# Altium schematic sheet Schematic.SchDoc
size A4; SheetNumber: 1; SheetTotal: 4
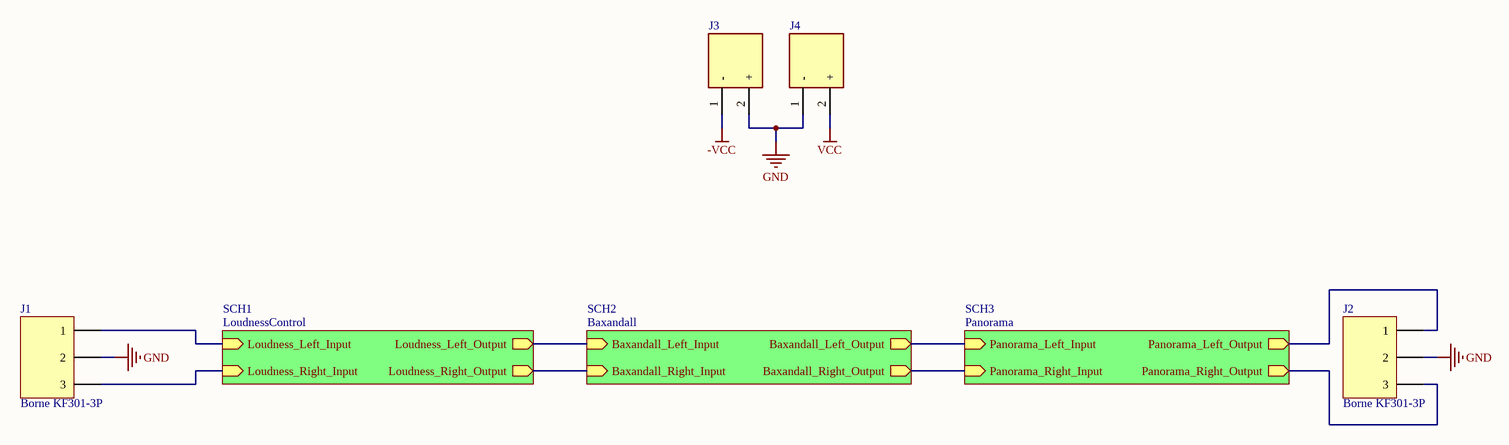
[diagram p0: Schematic.SchDoc]

## Parts
J1  Borne KF301-3P  [Borne KF301-3P]
J2  Borne KF301-3P  [Borne KF301-3P]
J3  Borne KF301-2P  [Borne KF301-2P]  (value not drawn)
J4  Borne KF301-2P  [Borne KF301-2P]  (value not drawn)

## Sub-sheets
SCH1 = LoudnessControl: Loudness_Left_Input (in), Loudness_Right_Input (in), Loudness_Left_Output (out), Loudness_Right_Output (out)
SCH2 = Baxandall: Baxandall_Left_Input (in), Baxandall_Right_Input (in), Baxandall_Left_Output (out), Baxandall_Right_Output (out)
SCH3 = Panorama: Panorama_Left_Input (in), Panorama_Right_Input (in), Panorama_Left_Output (out), Panorama_Right_Output (out)

## Nets
-VCC: J3.1(-)
GND: J1.2 J2.2 J3.2(+) J4.1(-)
VCC: J4.2(+)
NetJ1_1: J1.1 ; sheet SCH1/Loudness_Left_Input
NetJ1_3: J1.3 ; sheet SCH1/Loudness_Right_Input
NetJ2_1: J2.1 ; sheet SCH3/Panorama_Left_Output
NetJ2_3: J2.3 ; sheet SCH3/Panorama_Right_Output
(unnamed): sheet SCH1/Loudness_Left_Output, sheet SCH2/Baxandall_Left_Input
(unnamed): sheet SCH1/Loudness_Right_Output, sheet SCH2/Baxandall_Right_Input
(unnamed): sheet SCH2/Baxandall_Left_Output, sheet SCH3/Panorama_Left_Input
(unnamed): sheet SCH2/Baxandall_Right_Output, sheet SCH3/Panorama_Right_Input

## Library data of the parts
J3 J4 = Borne KF301-2P: 2 Pin Terminal Block 5mm Pitch; Price: None; Value: *; MP: KF301-2P; Package: None; Availability: Unavailable